# Altium schematic sheet [4]-DISPLAY_ERC12864FS.SchDoc
size A3; SheetNumber: 5; SheetTotal: 8
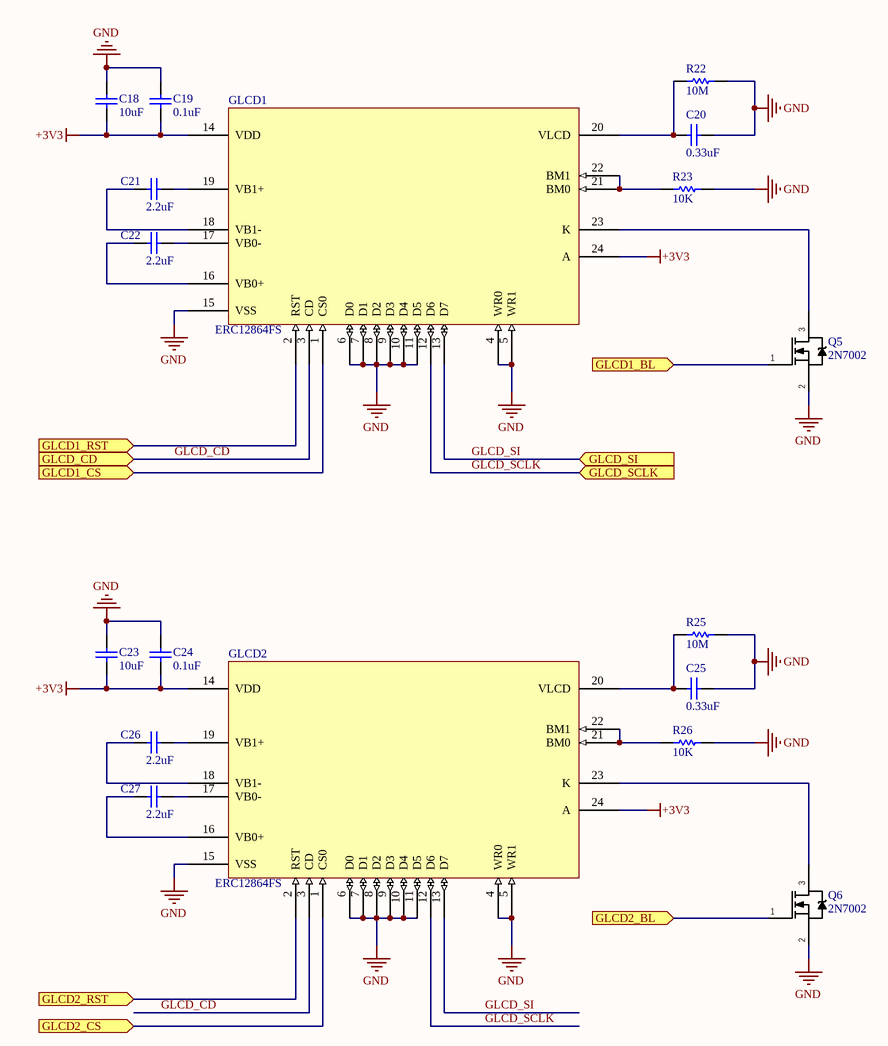
[diagram p0: [4]-DISPLAY_ERC12864FS.SchDoc]

## Parts
C18  10uF  [CAPC1608N]
C19  0.1uF  [CAPC1608N]
C20  0.33uF  [CAPC2012N]
C21  2.2uF  [CAPC2012N]
C22  2.2uF  [CAPC2012N]
C23  10uF  [CAPC1608N]
C24  0.1uF  [CAPC1608N]
C25  0.33uF  [CAPC2012N]
C26  2.2uF  [CAPC2012N]
C27  2.2uF  [CAPC2012N]
GLCD1  ERC12864FS  [ERC12864FS]
GLCD2  ERC12864FS  [ERC12864FS]
Q5  2N7002  [SOT23-3N]
Q6  2N7002  [SOT23-3N]
R22  10M  [RESC1608N]
R23  10K  [RESC1608N]
R25  10M  [RESC1608N]
R26  10K  [RESC1608N]

## Ports
GLCD1_BL (in), GLCD1_CS (in), GLCD1_RST (in), GLCD2_BL (in), GLCD2_CS (in), GLCD2_RST (in), GLCD_CD (in), GLCD_SCLK (in), GLCD_SI (in)

## Nets
+3V3: C18.1 C19.1 C23.1 C24.1 GLCD1.14(VDD) GLCD1.24(A) GLCD2.14(VDD) GLCD2.24(A)
GND: C18.2 C19.2 C20.2 C23.2 C24.2 C25.2 GLCD1.4(WR0) GLCD1.5(WR1) GLCD1.6(D0) GLCD1.7(D1) GLCD1.8(D2) GLCD1.9(D3) GLCD1.10(D4) GLCD1.11(D5) GLCD1.15(VSS) GLCD2.4(WR0) GLCD2.5(WR1) GLCD2.6(D0) GLCD2.7(D1) GLCD2.8(D2) GLCD2.9(D3) GLCD2.10(D4) GLCD2.11(D5) GLCD2.15(VSS) Q5.2(S) Q6.2(S) R22.2 R23.1 R25.2 R26.1
GLCD1_BL: Q5.1(G) ; port GLCD1_BL
GLCD1_CS: GLCD1.1(CS0) ; port GLCD1_CS
GLCD1_RST: GLCD1.2(RST) ; port GLCD1_RST
GLCD2_BL: Q6.1(G) ; port GLCD2_BL
GLCD2_CS: GLCD2.1(CS0) ; port GLCD2_CS
GLCD2_RST: GLCD2.2(RST) ; port GLCD2_RST
GLCD_CD: GLCD1.3(CD) GLCD2.3(CD) ; port GLCD_CD
GLCD_SCLK: GLCD1.12(D6) GLCD2.12(D6) ; port GLCD_SCLK
GLCD_SI: GLCD1.13(D7) GLCD2.13(D7) ; port GLCD_SI
NetC20_1: C20.1 GLCD1.20(VLCD) R22.1
NetC21_1: C21.1 GLCD1.18(VB1-)
NetC21_2: C21.2 GLCD1.19(VB1+)
NetC22_1: C22.1 GLCD1.16(VB0+)
NetC22_2: C22.2 GLCD1.17(VB0-)
NetC25_1: C25.1 GLCD2.20(VLCD) R25.1
NetC26_1: C26.1 GLCD2.18(VB1-)
NetC26_2: C26.2 GLCD2.19(VB1+)
NetC27_1: C27.1 GLCD2.16(VB0+)
NetC27_2: C27.2 GLCD2.17(VB0-)
NetGLCD1_21: GLCD1.21(BM0) GLCD1.22(BM1) R23.2
NetGLCD1_23: GLCD1.23(K) Q5.3(D)
NetGLCD2_21: GLCD2.21(BM0) GLCD2.22(BM1) R26.2
NetGLCD2_23: GLCD2.23(K) Q6.3(D)

## Library data of the parts
C18 C23 = GRM188R61A106KE69D: CAP CER 10UF 10V X5R 0603; Manufacturer 1: Murata; Tolerance: 10%; Supplier 1: Digi-Key; Manufacturer Part Number 1: GRM188R61A106KE69D; Stock 1: 40000; Pricing 1: 1=0.22, 10=0.149, 100=0.0754, 500=0.05158, 1000=0.04563 (USD); Mount: Surface Mount; Case/Package: 0603; Case Code (Metric): 1608; Case Code (Imperial): 0603; Min Operating Temperature: -55°C; Max Operating Temperature: 85°C; Capacitance: 10uF; Packaging: Tape and Reel; Dielectric: X5R; Voltage Rating: 10V; Voltage: 10V; Voltage Rating (DC): 10V; Length: 1.6mm; Height: 0.8mm; Width: 0.031inch; Thickness: 0.037inch; Depth: 0.8mm; REACH SVHC: No SVHC; Lead Free: Lead Free; Supplier Part Number 1: 490-10474-1-ND
C19 C24 = CC0603KRX7R8BB104: CAP CER 0.1UF 25V X7R 0603; Manufacturer 1: Yageo; Capacitance: 100nF; Tolerance: 10%; Supplier 1: Digi-Key; Manufacturer Part Number 1: CC0603KRX7R8BB104; Stock 1: 40000; Pricing 1: 1=0.1, 10=0.074, 100=0.0329, 500=0.02352, 1000=0.01848 (USD); Mount: Surface Mount; Case/Package: 0603; Number of Pins: 2; Case Code (Imperial): 0603; Case Code (Metric): 1608; Min Operating Temperature: -55°C; Max Operating Temperature: 125°C; Dielectric: X7R; Voltage Rating: 25V; Packaging: Tape and Reel; Package Quantity: 1; Voltage Rating (DC): 25V; Termination: SMD/SMT; Composition: Ceramic; Voltage: 25V; Length: 1.6mm; Height: 0.8mm; Width: 0.8mm; Thickness: 0.035inch; Depth: 0.8mm; Radiation Hardening: No; REACH SVHC: Unknown; Lead Free: Lead Free; Halogen Free: Halogen Free; ComponentLink1URL: https://datasheet.ciiva.com/11786/0900766b80c10176-11786120.pdf; ComponentLink1Description: https://datasheet.ciiva.com/11786/0900766b80c10176-11786120.pdf; ComponentLink2URL: https://datasheet.ciiva.com/144/mlccorderingcode-144075.pdf; ComponentLink2Description: https://datasheet.ciiva.com/144/mlccorderingcode-144075.pdf; ComponentLink3URL: https://datasheet.ciiva.com/17434/upy-gphc-x7r-6-3v-to-50v-8-17434263.pdf; ComponentLink3Description: https://datasheet.ciiva.com/17434/upy-gphc-x7r-6-3v-to-50v-8-17434263.pdf; ComponentLink4URL: https://datasheet.ciiva.com/26829/getdatasheetpartid-403577-26829431.pdf; ComponentLink4Description: https://datasheet.ciiva.com/26829/getdatasheetpartid-403577-26829431.pdf; ComponentLink5URL: https://datasheet.ciiva.com/11587/upy-gphc-x7r-6-3v-to-50v-8-11587208.pdf; ComponentLink5Description: https://datasheet.ciiva.com/11587/upy-gphc-x7r-6-3v-to-50v-8-11587208.pdf; ComponentLink6URL: https://datasheet.ciiva.com/13389/upy-gphc-x7r-6-3v-to-50v-8-13389352.pdf; ComponentLink6Description: https://datasheet.ciiva.com/13389/upy-gphc-x7r-6-3v-to-50v-8-13389352.pdf; ComponentLink7URL: https://datasheet.ciiva.com/28450/1489800-28450584.pdf; ComponentLink7Description: https://datasheet.ciiva.com/28450/1489800-28450584.pdf; ComponentLink8URL: https://datasheet.ciiva.com/144/mlccorderingcode-144073.pdf; ComponentLink8Description: https://datasheet.ciiva.com/144/mlccorderingcode-144073.pdf; ComponentLink9URL: https://datasheet.ciiva.com/144/mlccorderingcode-144074.pdf; ComponentLink9Description: https://datasheet.ciiva.com/144/mlccorderingcode-144074.pdf; ComponentLink10URL: https://datasheet.ciiva.com/7978/1489800-7978155.pdf; ComponentLink10Description: https://datasheet.ciiva.com/7978/1489800-7978155.pdf; Supplier Part Number 1: 311-1341-1-ND
C20 C25 = C0805C334K5RACAUTO: CAP CER 0.33UF 50V X7R 0805; Manufacturer 1: Kemet; Description 1: Multilayer Ceramic Capacitors MLCC - SMD/SMT 0.33uF 50volts 10% X7R; Capacitance - nF: 330 nF; Capacitance - pF: 330000 pF; Case Height: 0.9 mm; Case Length: 2 mm; Case Width: 1.2 mm; Class: Class 1; Tolerance: 10 %; Temperature Coefficient / Code: +/- 15 %; Type: SMD MLCC X7R 6.3 - 250 VDC Commerical Grade; Supplier 1: Digi-Key; Manufacturer Part Number 1: C0805C334K5RACAUTO; Stock 1: 76; Pricing 1: 1=0.21, 10=0.142, 100=0.0721, 500=0.0493, 1000=0.0436 (USD); Brand: Kemet; Capacitance: 0.33 uF; Case Code - in: 0805; Case Code - mm: 2012; Dimensions: 1.2 mm W x 2 mm L x 0.9 mm H; Dielectric: X7R; Factory Pack Quantity: 4000; Voltage Rating: 50 V; Product Category: Multilayer Ceramic Capacitors MLCC - SMD/SMT; RoHS: Details; Voltage Rating DC: 50 V; Minimum Operating Temperature: - 55 C; Maximum Operating Temperature: + 125 C; Product: Automotive MLCCs; Operating Temperature Range: - 55 C to + 125 C; Package / Case: 0805 (2012 metric); Packaging: Reel; Series: C0805C; Termination Style: SMD/SMT; ComponentLink1URL: https://datasheet.ciiva.com/7842/1776105-7842326.pdf; ComponentLink1Description: https://datasheet.ciiva.com/7842/1776105-7842326.pdf; ComponentLink2URL: https://datasheet.ciiva.com/22705/1776105-22705463.pdf; ComponentLink2Description: https://datasheet.ciiva.com/22705/1776105-22705463.pdf; Supplier Part Number 1: 399-6959-1-ND; Supplier 2: Digi-Key; Supplier Part Number 2: 1276-1808-1-ND; Manufacturer 2: Samsung; Manufacturer Part Number 2: CL21B334KAFNNNE
C21 C22 C26 C27 = C2012X7R1C225K125AB: CAP CER 2.2UF 16V X7R 0805; Manufacturer 1: TDK; Dielectric Material: Ceramic; Tolerance: 10%; Supplier 1: Digi-Key; Manufacturer Part Number 1: C2012X7R1C225K125AB; Stock 1: 20000; Pricing 1: 1=0.28, 10=0.194, 100=0.0983, 500=0.06728, 1000=0.05951 (USD); Mount: Surface Mount; Case/Package: 0805; Number of Pins: 2; Weight: 0.000194oz; Case Code (Imperial): 0805; Case Code (Metric): 2012; Min Operating Temperature: -55°C; Max Operating Temperature: 125°C; Capacitance: 2.2uF; Dielectric: X7R; Packaging: Tape and Reel; Package Quantity: 2000; Voltage Rating: 16V; Voltage Rating (DC): 16V; Termination: SMD/SMT; Voltage: 16V; Composition: Ceramic; Length: 2mm; Height: 1.25mm; Width: 1.25mm; Depth: 1.25mm; Thickness: 0.057inch; Radiation Hardening: No; REACH SVHC: No SVHC; Lead Free: Lead Free; ComponentLink1URL: https://datasheet.ciiva.com/24219/c2012x7r1c225k125ab-265065-24219730.pdf; ComponentLink1Description: https://datasheet.ciiva.com/24219/c2012x7r1c225k125ab-265065-24219730.pdf; ComponentLink2URL: https://datasheet.ciiva.com/11788/0900766b80c1bb00-11788135.pdf; ComponentLink2Description: https://datasheet.ciiva.com/11788/0900766b80c1bb00-11788135.pdf; ComponentLink3URL: https://datasheet.ciiva.com/26834/getdatasheetpartid-736487-26834421.pdf; ComponentLink3Description: https://datasheet.ciiva.com/26834/getdatasheetpartid-736487-26834421.pdf; ComponentLink4URL: https://datasheet.ciiva.com/16482/e412-c-16482422.pdf; ComponentLink4Description: https://datasheet.ciiva.com/16482/e412-c-16482422.pdf; ComponentLink5URL: https://datasheet.ciiva.com/6291/tdkmlcccaprange-6291383.pdf; ComponentLink5Description: https://datasheet.ciiva.com/6291/tdkmlcccaprange-6291383.pdf; ComponentLink6URL: https://datasheet.ciiva.com/6291/tdkmlcccaprange-6291384.pdf; ComponentLink6Description: https://datasheet.ciiva.com/6291/tdkmlcccaprange-6291384.pdf; ComponentLink7URL: https://datasheet.ciiva.com/22648/1796654-22648712.pdf; ComponentLink7Description: https://datasheet.ciiva.com/22648/1796654-22648712.pdf; ComponentLink8URL: https://datasheet.ciiva.com/6291/tdkmlcccaprange-6291450.pdf; ComponentLink8Description: https://datasheet.ciiva.com/6291/tdkmlcccaprange-6291450.pdf; ComponentLink9URL: https://datasheet.ciiva.com/22694/1796654-22694143.pdf; ComponentLink9Description: https://datasheet.ciiva.com/22694/1796654-22694143.pdf; Supplier Part Number 1: 445-1420-1-ND
GLCD1 GLCD2 = ERC12864FS-655: SERIAL SPI 2.8"GLCD 128x64 UC1701 CONTROLLER; Manufacturer 1: EastRising; Manufacturer Part Number 1: ERC12864FS-655; Supplier 1: EastRising; Supplier Part Number 1: ERC12864FS-655
Q5 Q6 = 2N7002: MOSFET N-CH 60V 115MA SOT-23; Manufacturer 1: ON Semiconductor / Fairchild; Max Power Dissipation: 200mW; Drain to Source Resistance: 1.2R; Gate to Source Voltage (Vgs): 20V; Nominal Vgs: 2.1V; Number of Elements: 1; Element Configuration: Single; Input Capacitance: 50pF; Rds On Max: 7.5R; On-State Resistance: 5.3R; Supplier 1: Digi-Key; Manufacturer Part Number 1: 2N7002; Stock 1: 111118; Pricing 1: 1=0.33, 10=0.304, 100=0.17, 500=0.09108, 1000=0.06193 (USD); Mount: Surface Mount; Case/Package: SOT-23; Number of Pins: 3; Contact Plating: Tin,Matte; Min Operating Temperature: -55°C; Max Operating Temperature: 150°C; Continuous Drain Current (ID): 115mA; Packaging: Tape and Reel; Package Quantity: 1; Drain to Source Voltage (Vdss): 60V; Drain to Source Breakdown Voltage: 60V; Power Dissipation: 200mW; Threshold Voltage: 2.1V; Voltage Rating (DC): 60V; Current Rating: 115mA; Dual Supply Voltage: 60V; Current: 115mA; Voltage: 60V; Length: 2.92mm; Height: 0.93mm; Width: 3.05mm; Radiation Hardening: No; REACH SVHC: No SVHC; Lead Free: Lead Free; ComponentLink1URL: https://datasheet.ciiva.com/931/2n7000-931777.pdf; ComponentLink1Description: https://datasheet.ciiva.com/931/2n7000-931777.pdf; ComponentLink2URL: https://datasheet.ciiva.com/27746/47-0120-27746881.pdf; ComponentLink2Description: https://datasheet.ciiva.com/27746/47-0120-27746881.pdf; ComponentLink3URL: https://datasheet.ciiva.com/1254/2n7002-1254451.pdf; ComponentLink3Description: https://datasheet.ciiva.com/1254/2n7002-1254451.pdf; ComponentLink4URL: https://datasheet.ciiva.com/15137/getdatasheetpartid-93547-15137771.pdf; ComponentLink4Description: https://datasheet.ciiva.com/15137/getdatasheetpartid-93547-15137771.pdf; ComponentLink5URL: https://datasheet.ciiva.com/931/2n7000-931762.pdf; ComponentLink5Description: https://datasheet.ciiva.com/931/2n7000-931762.pdf; ComponentLink6URL: https://datasheet.ciiva.com/931/2n7000-931763.pdf; ComponentLink6Description: https://datasheet.ciiva.com/931/2n7000-931763.pdf; ComponentLink7URL: https://datasheet.ciiva.com/931/2n7000-931764.pdf; ComponentLink7Description: https://datasheet.ciiva.com/931/2n7000-931764.pdf; ComponentLink8URL: https://datasheet.ciiva.com/1254/660093-1254452.pdf; ComponentLink8Description: https://datasheet.ciiva.com/1254/660093-1254452.pdf; ComponentLink9URL: https://datasheet.ciiva.com/1188/660093-1188359.pdf; ComponentLink9Description: https://datasheet.ciiva.com/1188/660093-1188359.pdf; ComponentLink10URL: https://datasheet.ciiva.com/1188/660093-1188361.pdf; ComponentLink10Description: https://datasheet.ciiva.com/1188/660093-1188361.pdf; ComponentLink11URL: https://datasheet.ciiva.com/17007/2n7002-17007243.pdf; ComponentLink11Description: https://datasheet.ciiva.com/17007/2n7002-17007243.pdf; ComponentLink12URL: https://datasheet.ciiva.com/3304/nds7002a-3304380.pdf; ComponentLink12Description: https://datasheet.ciiva.com/3304/nds7002a-3304380.pdf; ComponentLink13URL: https://datasheet.ciiva.com/3304/nds7002a-3304381.pdf; ComponentLink13Description: https://datasheet.ciiva.com/3304/nds7002a-3304381.pdf; ComponentLink14URL: https://datasheet.ciiva.com/22655/660093-22655230.pdf; ComponentLink14Description: https://datasheet.ciiva.com/22655/660093-22655230.pdf; Supplier Part Number 1: 2N7002NCT-ND
R22 R25 = CR0603-JW-106ELF: RES SMD 10M OHM 5% 1/10W 0603; Manufacturer 1: Bourns; Resistance: 10MR; Temperature Coefficient: 200ppm/°C; Power Rating: 100mW; Voltage Rating: 50V; Supplier 1: Digi-Key; Manufacturer Part Number 2: CR0603-JW-106ELF; Stock 1: 29967; Pricing 1: 1=0.1, 10=0.016, 100=0.0064, 1000=0.00289, 2500=0.0025 (USD); Mount: Surface Mount; Case/Package: 0603; Contact Plating: Tin; Case Code (Imperial): 0603; Case Code (Metric): 1608; Min Operating Temperature: -55°C; Max Operating Temperature: 155°C; Tolerance: 5%; Composition: Thick Film; Packaging: Tape and Reel; Package Quantity: 5000; Termination: SMD/SMT; Number of Terminations: 2; Max Power Dissipation: 100mW; Military Standard: Not; Length: 1.6mm; Height: 0.022inch; Width: 0.8mm; Thickness: 457um; Depth: 0.8mm; Radiation Hardening: No; ComponentLink1URL: https://datasheet.ciiva.com/9122/chpreztr-9122300.pdf; ComponentLink1Description: https://datasheet.ciiva.com/9122/chpreztr-9122300.pdf; ComponentLink2URL: https://datasheet.ciiva.com/18605/chpreztr-18605117.pdf; ComponentLink2Description: https://datasheet.ciiva.com/18605/chpreztr-18605117.pdf; ComponentLink3URL: https://datasheet.ciiva.com/18605/chpreztr-18605118.pdf; ComponentLink3Description: https://datasheet.ciiva.com/18605/chpreztr-18605118.pdf; ComponentLink4URL: https://datasheet.ciiva.com/18605/chpreztr-18605119.pdf; ComponentLink4Description: https://datasheet.ciiva.com/18605/chpreztr-18605119.pdf; Supplier Part Number 1: CR0603-JW-106ELFCT-ND
R23 R26 = AC0603JR-0710KL: RES SMD 10K OHM 5% 1/10W 0603; Manufacturer 1: Yageo; Voltage Rating: 50V; Resistance: 10kR; Power Rating: 100mW; Temperature Coefficient: 100ppm/°C; Supplier 1: Digi-Key; Manufacturer Part Number 1: AC0603JR-0710KL; Stock 1: 60451; Pricing 1: 1=0.1, 10=0.032, 100=0.0131, 1000=0.00588, 2500=0.0051 (USD); Case/Package: 0603; Case Code (Imperial): 0603; Case Code (Metric): 1608; Min Operating Temperature: -55°C; Max Operating Temperature: 155°C; Packaging: Tape and Reel; Tolerance: 5%; Package Quantity: 1; Composition: Thick Film; Termination: SMD/SMT; Number of Terminations: 2; Military Standard: Not; Max Power Dissipation: 100mW; Features: Moisture Resistant,Automotive AEC-Q200,Anti-Sulfur; Length: 0.063inch; Height: 0.022inch; Width: 0.031inch; Depth: 0.8mm; Lead Free: Lead Free; ComponentLink1URL: https://datasheet.ciiva.com/5562/pyu-ac-51-rohs-l-2-5562553.pdf; ComponentLink1Description: https://datasheet.ciiva.com/5562/pyu-ac-51-rohs-l-2-5562553.pdf; Supplier Part Number 1: 311-10KLECT-ND